# EAGLE design pcbmodule (EAGLE 6.6.0)
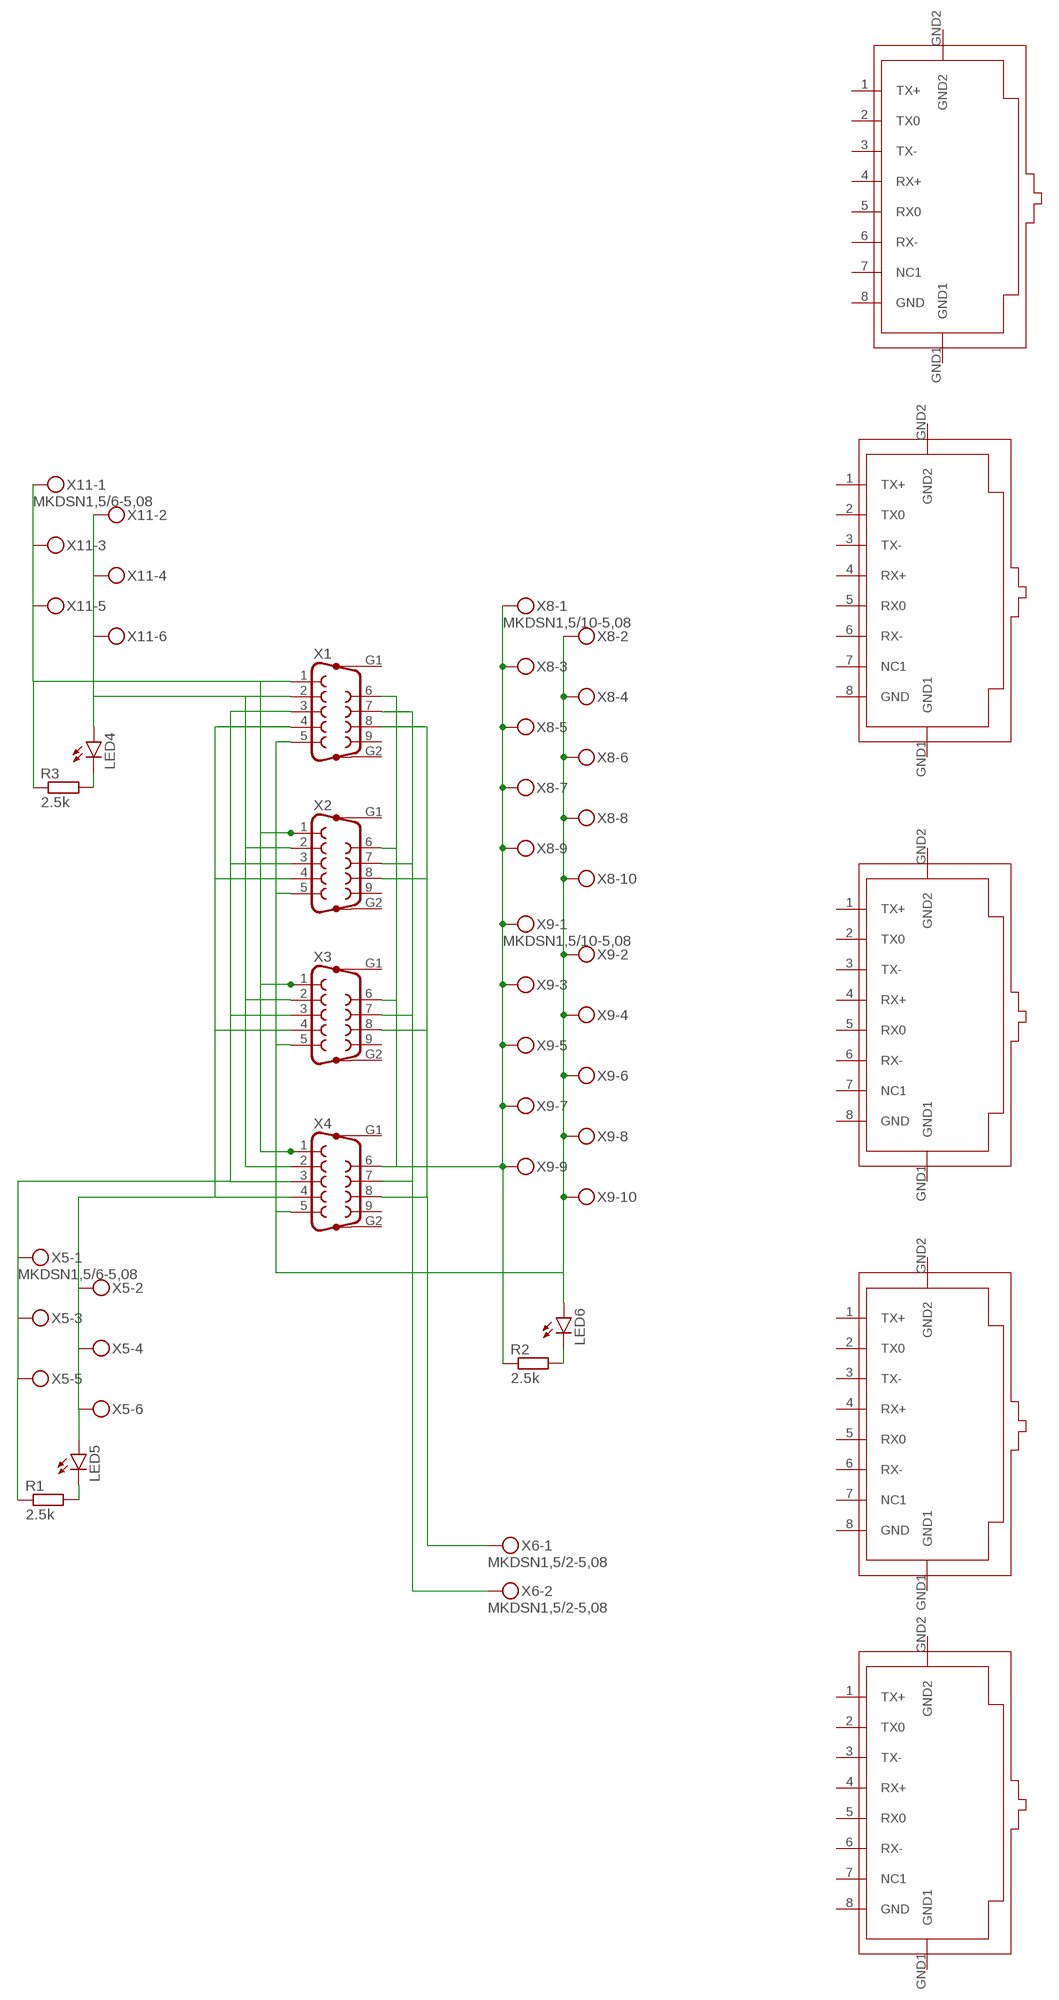
[diagram p0: schematic, sheet 1]

## Parts
LED4  LED5MM  [LED5MM]
LED5  LED5MM  [LED5MM]
LED6  LED5MM  [LED5MM]
R1  2.5k  R-EU_0204/7  [0204/7]
R2  2.5k  R-EU_0204/7  [0204/7]
R3  2.5k  R-EU_0204/7  [0204/7]
U$1  RJ45-TRAFO  [RJ45-RJHSE5E8X]
U$2  RJ45-TRAFO  [RJ45-RJHSE5E8X]
U$3  RJ45-TRAFO  [RJ45-RJHSE5E8X]
U$4  RJ45-TRAFO  [RJ45-RJHSE5E8X]
U$5  RJ45-TRAFO  [RJ45-RJHSE5E8X]
X1  F09VP  [F09VP]
X2  F09VP  [F09VP]
X3  F09VP  [F09VP]
X4  F09VP  [F09VP]
X5  MKDSN1,5/6-5,08  [MKDSN1,5/6-5,08]
X6  MKDSN1,5/2-5,08  [MKDSN1,5/2-5,08]
X8  MKDSN1,5/10-5,08  [MKDSN1,5/10-5,08]
X9  MKDSN1,5/10-5,08  [MKDSN1,5/10-5,08]
X11  MKDSN1,5/6-5,08  [MKDSN1,5/6-5,08]

## Nets
N$1 [power 16v ac]: R3.1 X1.1 X2.1 X3.1 X4.1 X11.1 X11.3 X11.5
N$2 [power 16v ac]: LED4.A X1.2 X2.2 X3.2 X4.2 X11.2 X11.4 X11.6
N$4: R1.1 X1.3 X2.3 X3.3 X4.3 X5.1 X5.3 X5.5
N$5: LED4.K(C) R3.2
N$6: LED5.A X1.4 X2.4 X3.4 X4.4 X5.2 X5.4 X5.6
N$14 [dcc rail]: LED6.A X1.5 X2.5 X3.5 X4.5 X8.2 X8.4 X8.6 X8.8 X8.10 X9.2 X9.4 X9.6 X9.8 X9.10
N$15: LED5.K(C) R1.2
N$16: LED6.K(C) R2.2
N$17 [dcc rail]: R2.1 X1.6 X2.6 X3.6 X4.6 X8.1 X8.3 X8.5 X8.7 X8.9 X9.1 X9.3 X9.5 X9.7 X9.9
N$18: X1.7 X2.7 X3.7 X4.7 X6.2
N$19: X1.8 X2.8 X3.8 X4.8 X6.1
Unconnected: U$1.1(TX+) U$1.2(TX0) U$1.3(TX-) U$1.4(RX+) U$1.5(RX0) U$1.6(RX-) U$1.7(NC1) U$1.8(GND) U$1.GND1 U$1.GND2 U$2.1(TX+) U$2.2(TX0) U$2.3(TX-) U$2.4(RX+) U$2.5(RX0) U$2.6(RX-) U$2.7(NC1) U$2.8(GND) U$2.GND1 U$2.GND2 U$3.1(TX+) U$3.2(TX0) U$3.3(TX-) U$3.4(RX+) U$3.5(RX0) U$3.6(RX-) U$3.7(NC1) U$3.8(GND) U$3.GND1 U$3.GND2 U$4.1(TX+) U$4.2(TX0) U$4.3(TX-) U$4.4(RX+) U$4.5(RX0) U$4.6(RX-) U$4.7(NC1) U$4.8(GND) U$4.GND1 U$4.GND2 U$5.1(TX+) U$5.2(TX0) U$5.3(TX-) U$5.4(RX+) U$5.5(RX0) U$5.6(RX-) U$5.7(NC1) U$5.8(GND) U$5.GND1 U$5.GND2 X1.9 X1.G1 X1.G2 X2.9 X2.G1 X2.G2 X3.9 X3.G1 X3.G2 X4.9 X4.G1 X4.G2

## Library data of the parts
LED4-LED6 = SparkFun-LED:LED: LEDs Standard schematic elements and footprints for 5mm, 3mm, 1206, and 0603 sized LEDs. 5mm - Spark Fun Electronics SKU : COM-00529 (and others)
R1-R3 = resistor:R-EU_: RESISTOR, European symbol
U$1-U$5 = con-amphenol-rj45-nzin:RJ45-TRAFO: RJ45 socket with integrated magnetics Naming: Amphenol LMJ1598824110DT39 TME RJ45-TRAFO Author: Petr Kalandra <mailto:kalandrap@gmail.com> Datasheet: http://zefiryn.tme.pl/dok/zlacza/rjtrafo.pdf
X1-X4 = con-subd:F09VP: SUB-D; OC_FARNELL: unknown; OC_NEWARK: unknown
X5 X11 = con-phoenix-508:MKDSN1,5/6-5,08: MKDSN 1,5/ 6-5,08 Printklemme Nennstrom: 13,5 A Nennspannung: 250 V Rastermaß: 5,08 mm Polzahl: 6 Anschlussart: Schraubanschluss Montage: Löten Anschlussrichtung Leiter/Platine: 0 ° Artikelnummer: 1729160 Source: http://eshop.phoenixcontact.com .. 1729160.pdf
X6 = con-phoenix-508:MKDSN1,5/2-5,08: MKDSN 1,5/ 2-5,08 Printklemme Nennstrom: 13,5 A Nennspannung: 250 V Rastermaß: 5,08 mm Polzahl: 2 Anschlussart: Schraubanschluss Montage: Löten Anschlussrichtung Leiter/Platine: 0 ° Artikelnummer: 1729128 Source: http://eshop.phoenixcontact.com .. 1729128.pdf
X8 X9 = con-phoenix-508:MKDSN1,5/10-5,08: MKDSN 1,5/10-5,08 Printklemme Nennstrom: 13,5 A Nennspannung: 250 V Rastermaß: 5,08 mm Polzahl: 10 Anschlussart: Schraubanschluss Montage: Löten Anschlussrichtung Leiter/Platine: 0 ° Artikelnummer: 1729209 Source: http://eshop.phoenixcontact.com .. 1729209.pdf

## Net classes
0 default: width 0.406 mm
1 power 16v ac: width 0.61 mm
2 dcc rail: width 0.508 mm

## Board
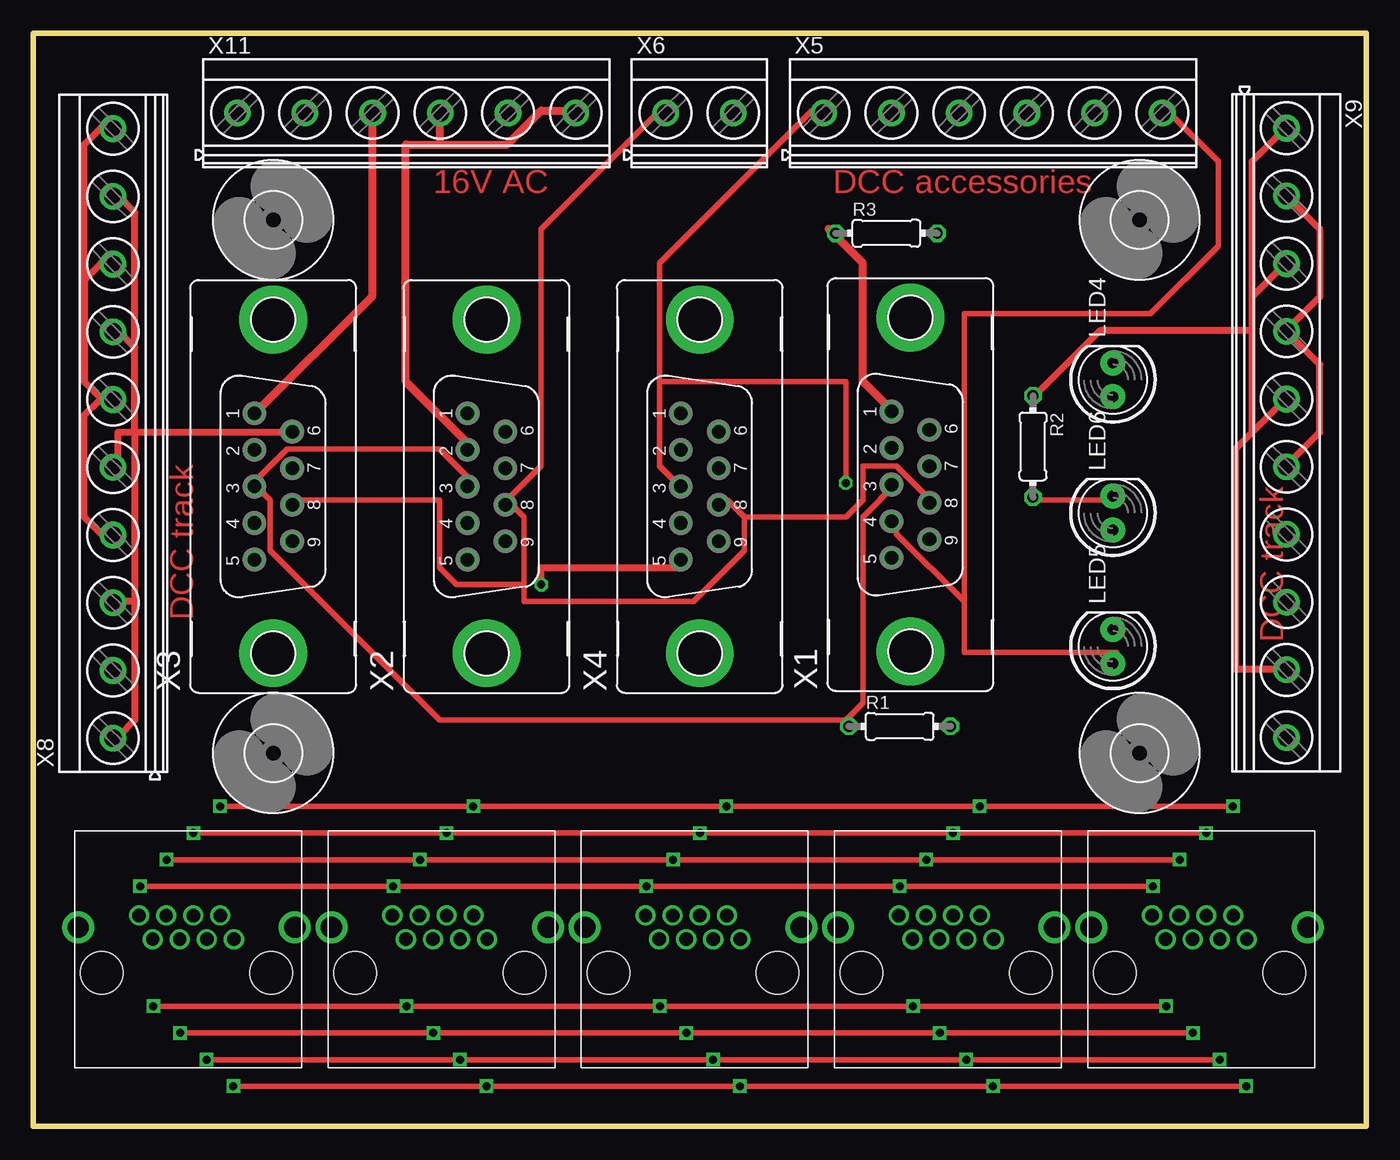
[diagram p1: board, top side]
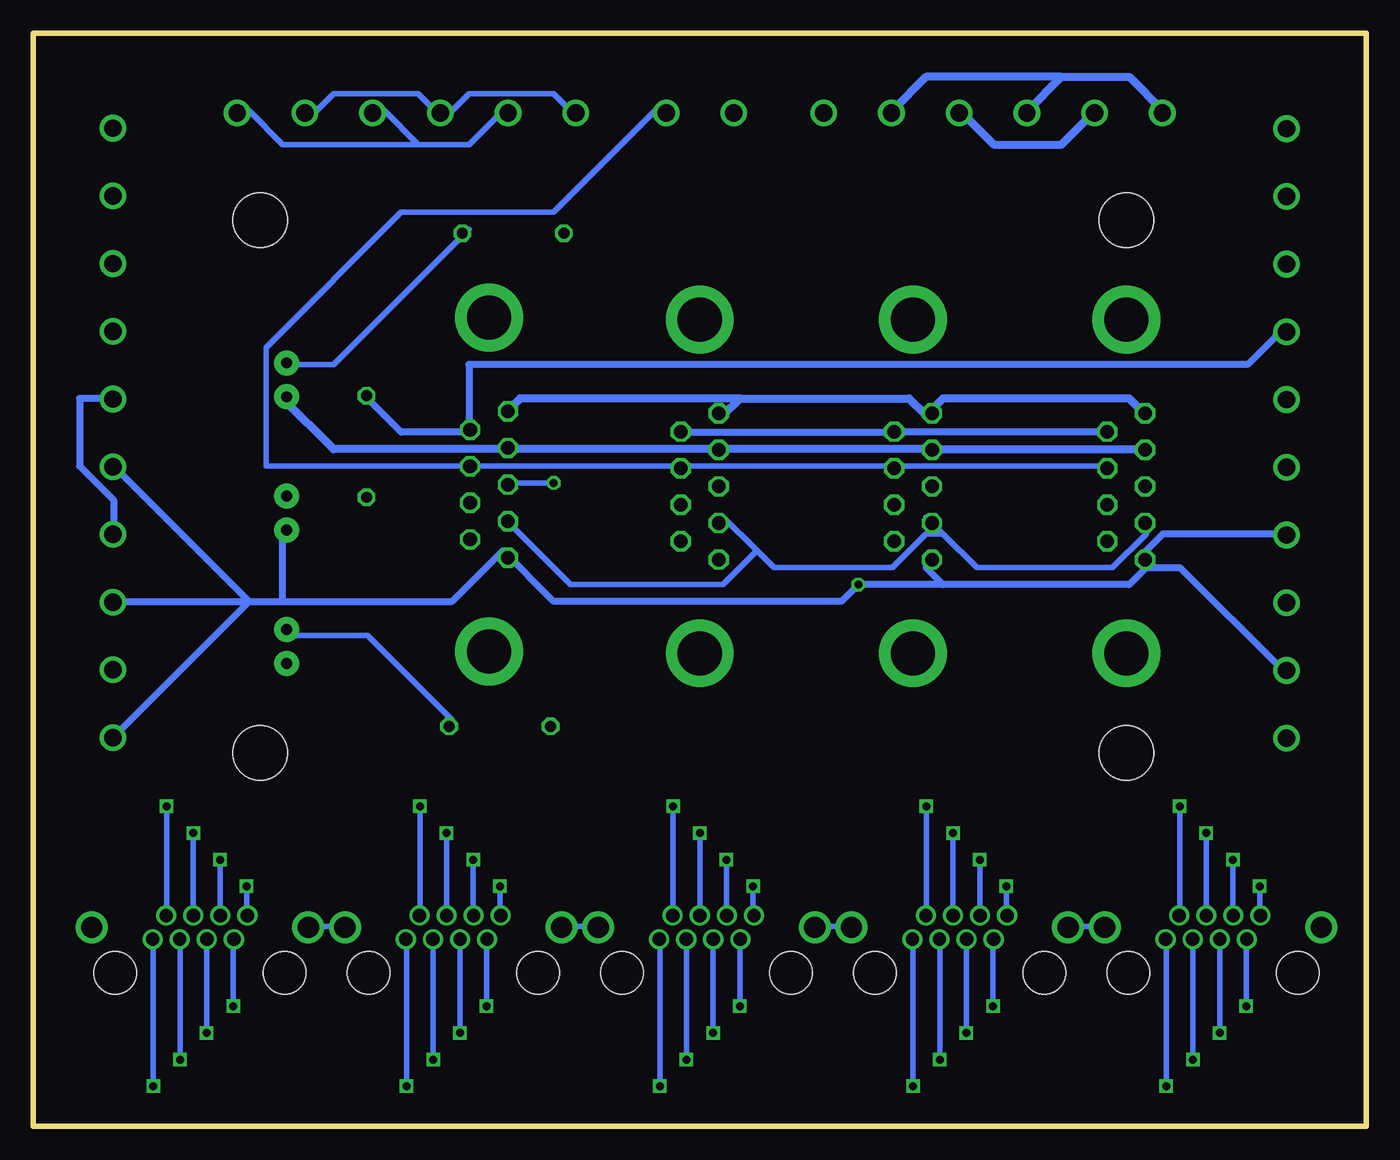
[diagram p2: board, bottom side, seen from below]

Size 100 x 82 mm. Coordinates in mm from the lower left corner, seen from the top.
Outline: 0,0 100,0 100,82 0,82 0,0
Copper layers (1*16): Top 0.035mm / dielectric 1.5mm / Bottom 0.035mm
Design rules "default": minimum track width 10mil, minimum drill 24mil, track to track 8mil, track to pad 8mil, pad to pad 8mil, via to via 8mil, smd to smd 8mil, copper to edge 40mil, drill to drill 8mil, minimum pad ring 10mil, minimum via ring 8mil, stop-mask expansion 4mil, vias tented up to drill 0mil, thermal gap 10mil

### Footprints (pad centres in the part's own frame; a part is rotated, then mirrored left to right if it is on the bottom)
LED5MM = drill 0.813 pad 1.88: A -1.27,0; K 1.27,0
0204/7 = drill 0.813 octagon: 1 -3.81,0; 2 3.81,0
RJ45-RJHSE5E8X = drill 1: 1 -3.048,2.032; 2 -4.064,3.81; 3 -1.016,2.032; 4 -2.032,3.81; 5 1.016,2.032; 6 0,3.81; 7 3.048,2.032; 8 2.032,3.81 | drill 1.6: GND1 -8.636,2.921; GND2 7.62,2.921 | hole 3.2: -6.858,-0.508; 5.842,-0.508
4,1 = hole 4.1: 0,0
F09VP = drill 1.016 octagon: 1 5.486,1.422; 2 2.743,1.422; 3 0,1.422; 4 -2.743,1.422; 5 -5.486,1.422; 6 4.115,-1.422; 7 1.372,-1.422; 8 -1.372,-1.422; 9 -4.115,-1.422 | drill 3.302 pad 5.08: G1 -12.522,0; G2 12.522,0
MKDSN1,5/6-5,08 = drill 1.3 pad 2: 1 -12.7,0.025; 2 -7.62,0.025; 3 -2.54,0.025; 4 2.54,0.025; 5 7.62,0.025; 6 12.7,0.025
MKDSN1,5/2-5,08 = drill 1.3 pad 2: 1 -2.561,0.025; 2 2.519,0.025
MKDSN1,5/10-5,08 = drill 1.3 pad 2: 1 -22.881,0.025; 2 -17.801,0.025; 3 -12.721,0.025; 4 -7.641,0.025; 5 -2.561,0.025; 6 2.519,0.025; 7 7.599,0.025; 8 12.679,0.025; 9 17.759,0.025; 10 22.839,0.025

### Placement (x,y rotation side)
LED4  81,56 90 top
LED5  81,36 90 top
LED6  81,46 90 top
R1  65,30 0 top
R2  75,51 270 top
R3  64,67 0 top
U$1  12,12 0 top
U$2  31,12 0 top
U$3  50,12 0 top
U$4  69,12 0 top
U$5  88,12 0 top
U$6  [4,1]  18,68 0 top
U$7  [4,1]  18,28 0 top
U$8  [4,1]  83,28 0 top
U$9  [4,1]  83,68 0 top
X1  65.81,48.14 90 top
X2  34,48 90 top
X3  18,48 90 top
X4  50,48 90 top
X5  72,76 0 top
X6  50,76 0 top
X8  6,52 90 top
X9  94,52 270 top
X11  28,76 0 top

### Tracks (layer width: path | path; a pad name or v marks a point on that pad's centre or on a via)
N$1
  Top 0.61: R3.1 59.69,67.31 62.23,64.77 62.23,55.88 64.77,53.34 X1.1 | X3.1 16.51,53.34 25.4,62.23 25.4,76.2 X11.3
  Bottom 0.61: 33.02,53.34 34.29,54.61 46.99,54.61 | 46.99,54.61 48.26,53.34 X4.1 | 22.86,78.74 17.78,78.74 15.24,76.2 X11.1 | 22.86,78.74 25.4,76.2 X11.3 | 22.86,78.74 33.02,78.74 35.56,76.2 X11.5 | 33.02,53.34 31.75,54.61 17.78,54.61 16.51,53.34 X3.1 | 33.02,53.34 X2.1 | 46.99,54.61 63.5,54.61 64.77,53.34 X1.1
N$2
  Top 0.61: 30.48,73.66 35.56,73.66 38.1,76.2 40.64,76.2 X11.6 | 30.48,73.66 30.48,76.2 X11.4 | 30.48,73.66 27.94,73.66 27.94,55.88 33.02,50.8 X2.2
  Bottom 0.61: X11.2 20.32,76.2 22.86,73.66 27.94,73.66 30.48,76.2 X11.4 | 33.02,50.8 16.51,50.8 X3.2 | 33.02,50.8 48.26,50.8 | 33.02,50.8 X2.2 | 48.26,50.8 64.77,50.8 | 48.26,50.8 X4.2 | 64.77,50.8 77.47,50.8 81.28,54.61 LED4.A | 64.77,50.8 X1.2
N$3
  Bottom 0.406: 20,15 22,15
N$4  (via drill 0.61)
  Top 0.406: 46.99,55.88 46.99,64.77 58.42,76.2 X5.1 | 46.99,55.88 46.99,49.53 48.26,48.26 X4.3 | 16.51,48.26 19.05,50.8 30.48,50.8 33.02,48.26 X2.3 | 60.96,30.48 62.23,31.75 62.23,45.72 64.77,48.26 X1.3 | 16.51,48.26 17.78,46.99 17.78,43.18 30.48,30.48 60.96,30.48 | 16.51,48.26 X3.3 | 60.96,30.48 R1.1 | 46.99,55.88 60.96,55.88 v60.96,48.26
  Bottom 0.406: X5.5 78.74,76.2 77.47,77.47 71.12,77.47 69.85,76.2 X5.3 68.58,76.2 67.31,77.47 60.96,77.47 59.69,76.2 X5.1 | v60.96,48.26 64.77,48.26 X1.3
N$5
  Bottom 0.406: R3.2 67.31,67.31 77.47,57.15 81.28,57.15 LED4.K
N$6
  Top 0.406: 69.85,39.37 69.85,35.56 81.28,35.56 LED5.A | 69.85,39.37 64.77,44.45 64.77,45.72 X1.4 | 69.85,39.37 69.85,60.96 83.82,60.96 88.9,66.04 88.9,72.39 85.09,76.2 X5.6
  Bottom 0.406: 71.12,73.66 67.31,73.66 64.77,76.2 X5.2 | 71.12,73.66 73.66,76.2 X5.4 | 71.12,73.66 81.28,73.66 83.82,76.2 X5.6 | 31.75,44.45 33.02,45.72 X2.4 | 31.75,44.45 29.21,41.91 19.05,41.91 16.51,44.45 16.51,45.72 X3.4 | 45.72,43.18 44.45,41.91 35.56,41.91 33.02,44.45 31.75,44.45 | 45.72,43.18 48.26,45.72 X4.4 | 45.72,43.18 48.26,40.64 59.69,40.64 64.77,45.72 X1.4
N$7
  Bottom 0.406: 39,15 41,15
N$8
  Bottom 0.406: 58,15 60,15
N$9
  Bottom 0.406: 77,15 79,15
N$10  (via drill 0.6)
  Top 0.406: v8,18 v27,18 v46,18 v65,18 v84,18
  Bottom 0.406: 8,16 v8,18 | 27,16 v27,18 | v46,18 46,16 | v65,18 65,16 | v84,18 84,16
N$12  (via drill 0.6)
  Top 0.406: v12,22 v31,22 v50,22 v69,22 v88,22
  Bottom 0.406: 12,16 v12,22 | 31,16 v31,22 | v50,22 50,16 | v69,22 69,16 | v88,22 88,16
N$14  (via drill 0.61)
  Top 0.508: 93.98,59.69 96.52,62.23 96.52,67.31 93.98,69.85 X9.2 | 93.98,59.69 96.52,57.15 96.52,52.07 93.98,49.53 X9.6 | 93.98,59.69 X9.4 | 5.08,54.61 3.81,55.88 3.81,63.5 | 3.81,63.5 5.08,64.77 X8.8 | 3.81,63.5 3.81,73.66 5.08,74.93 X8.10 | v38.1,40.64 38.1,41.91 48.26,41.91 X4.5 | 5.08,54.61 3.81,53.34 3.81,45.72 5.08,44.45 X8.4 | 5.08,54.61 X8.6
  Bottom 0.508: 64.77,43.18 68.58,39.37 81.28,39.37 | 83.82,39.37 93.98,39.37 X9.8 | 83.82,39.37 81.28,39.37 | 81.28,39.37 81.28,44.45 LED6.A | 83.82,39.37 93.98,29.21 X9.10 | 83.82,39.37 93.98,49.53 X9.6 | X8.4 6.35,44.45 15.24,44.45 16.51,43.18 X3.5 16.51,41.91 | 31.75,40.64 33.02,41.91 X2.5 | 31.75,40.64 17.78,40.64 16.51,41.91 | 31.75,40.64 v38.1,40.64 39.37,39.37 60.96,39.37 64.77,43.18 | 16.51,41.91 13.97,41.91 6.35,34.29 X8.2 | 64.77,43.18 X1.5
N$15
  Bottom 0.406: R1.2 68.58,30.48 74.93,36.83 81.28,36.83 LED5.K
N$16
  Top 0.406: R2.2 74.93,46.99 81.28,46.99 LED6.K
N$17
  Top 0.508: 91.44,52.07 93.98,54.61 X9.5 | 91.44,52.07 90.17,50.8 90.17,34.29 93.98,34.29 X9.9 | 91.44,62.23 93.98,64.77 X9.3 | 91.44,52.07 91.44,59.69 | 91.44,59.69 91.44,62.23 | 91.44,62.23 91.44,72.39 93.98,74.93 X9.1 | 91.44,59.69 80.01,59.69 74.93,54.61 R2.1 | 7.62,52.07 6.35,52.07 6.35,49.53 X8.5 | 7.62,52.07 19.05,52.07 X3.6 | 7.62,52.07 7.62,39.37 | 7.62,39.37 7.62,30.48 6.35,29.21 X8.1 | 7.62,39.37 6.35,39.37 X8.3 | 7.62,58.42 6.35,59.69 X8.7 | 7.62,52.07 7.62,58.42 | 7.62,58.42 7.62,68.58 6.35,69.85 X8.9
  Bottom 0.508: 67.31,52.07 72.39,52.07 74.93,54.61 R2.1 | X9.7 93.98,44.45 93.98,46.99 96.52,49.53 96.52,54.61 93.98,54.61 X9.5 | 35.56,52.07 50.8,52.07 X4.6 | 35.56,52.07 19.05,52.07 X3.6 | 35.56,52.07 X2.6 | 67.31,52.07 67.31,57.15 8.89,57.15 6.35,59.69 X8.7 | 67.31,52.07 X1.6
N$18
  Bottom 0.406: 35.56,49.53 19.05,49.53 X3.7 | 67.31,49.53 52.07,49.53 X4.7 50.8,49.53 35.56,49.53 | 67.31,49.53 82.55,49.53 82.55,58.42 72.39,68.58 60.96,68.58 53.34,76.2 X6.2 | 67.31,49.53 X1.7 | 35.56,49.53 X2.7
N$19
  Top 0.406: 36.83,40.64 31.75,40.64 30.48,41.91 30.48,46.99 19.05,46.99 X3.8 | 36.83,40.64 36.83,45.72 35.56,46.99 | 53.34,45.72 52.07,46.99 X4.8 | 53.34,45.72 53.34,43.18 49.53,39.37 36.83,39.37 36.83,40.64 | 53.34,45.72 60.96,45.72 62.23,46.99 62.23,49.53 64.77,49.53 67.31,46.99 X1.8 | 35.56,46.99 38.1,49.53 38.1,67.31 46.99,76.2 X6.1 | 35.56,46.99 X2.8
N$21  (via drill 0.6)
  Top 0.406: v11,7 v30,7 v49,7 v68,7 v87,7
  Bottom 0.406: 11,14 v11,7 | 30,14 v30,7 | 49,14 v49,7 | 68,14 v68,7 | 87,14 v87,7
N$23  (via drill 0.6)
  Top 0.406: v15,3 v34,3 v53,3 v72,3 v91,3
  Bottom 0.406: 15,14 v15,3 | 34,14 v34,3 | 53,14 v53,3 | v72,3 72,14 | 91,14 v91,3
N$36  (via drill 0.6)
  Top 0.406: v85,9 v66,9 v47,9 v28,9 v9,9
  Bottom 0.406: 85,14 v85,9 | v66,9 66,14 | v47,9 47,14 | v28,9 28,14 | v9,9 9,14
N$38  (via drill 0.6)
  Top 0.406: v89,5 v70,5 v51,5 v32,5 v13,5
  Bottom 0.406: 89,14 v89,5 | v70,5 70,14 | v51,5 51,14 | v32,5 32,14 | v13,5 13,14
N$53  (via drill 0.6)
  Top 0.406: v86,20 v67,20 v48,20 v29,20 v10,20
  Bottom 0.406: v86,20 86,16 | 67,16 v67,20 | 48,16 v48,20 | v29,20 29,16 | v10,20 10,16
N$55  (via drill 0.6)
  Top 0.406: v90,24 v71,24 v52,24 v33,24 v14,24
  Bottom 0.406: v90,24 90,16 | v71,24 71,16 | 52,16 v52,24 | v33,24 33,16 | v14,24 14,16

### Text on the board
Top: 16V AC | DCC accessories | DCC track | DCC track